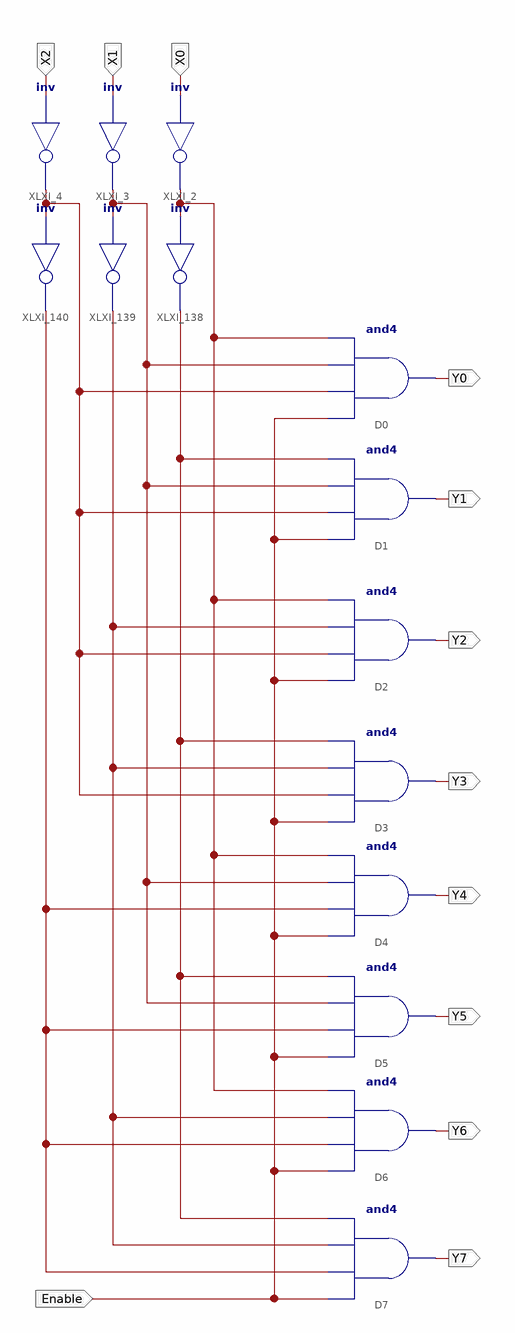
[diagram p0: schematic sheet 1]
// Xilinx ISE schematic three_to_eight_decoder.sch (spartan6) as structural Verilog: 14 symbols, 12 ports
module three_to_eight_decoder (
  input  X0,
  input  Enable,
  input  X1,
  input  X2,
  output Y0,
  output Y1,
  output Y2,
  output Y3,
  output Y4,
  output Y5,
  output Y6,
  output Y7
);

  wire XLXN_122, XLXN_131, XLXN_133, XLXN_136, XLXN_137, XLXN_138;

  and D0 (Y0, Enable, XLXN_137, XLXN_133, XLXN_122);
  and D7 (Y7, Enable, XLXN_138, XLXN_136, XLXN_131);
  and D6 (Y6, Enable, XLXN_138, XLXN_136, XLXN_122);
  and D5 (Y5, Enable, XLXN_138, XLXN_133, XLXN_131);
  and D4 (Y4, Enable, XLXN_138, XLXN_133, XLXN_122);
  and D3 (Y3, Enable, XLXN_137, XLXN_136, XLXN_131);
  and D2 (Y2, Enable, XLXN_137, XLXN_136, XLXN_122);
  and D1 (Y1, Enable, XLXN_137, XLXN_133, XLXN_131);
  not XLXI_2 (XLXN_122, X0);
  not XLXI_138 (XLXN_131, XLXN_122);
  not XLXI_3 (XLXN_133, X1);
  not XLXI_139 (XLXN_136, XLXN_133);
  not XLXI_4 (XLXN_137, X2);
  not XLXI_140 (XLXN_138, XLXN_137);
endmodule
